# EasyEDA schematic PSU.json
TITLE: Sheet_1; REV: 1.0; Date: 2023-02-11; Sheet: 1/1; Company: Your Company
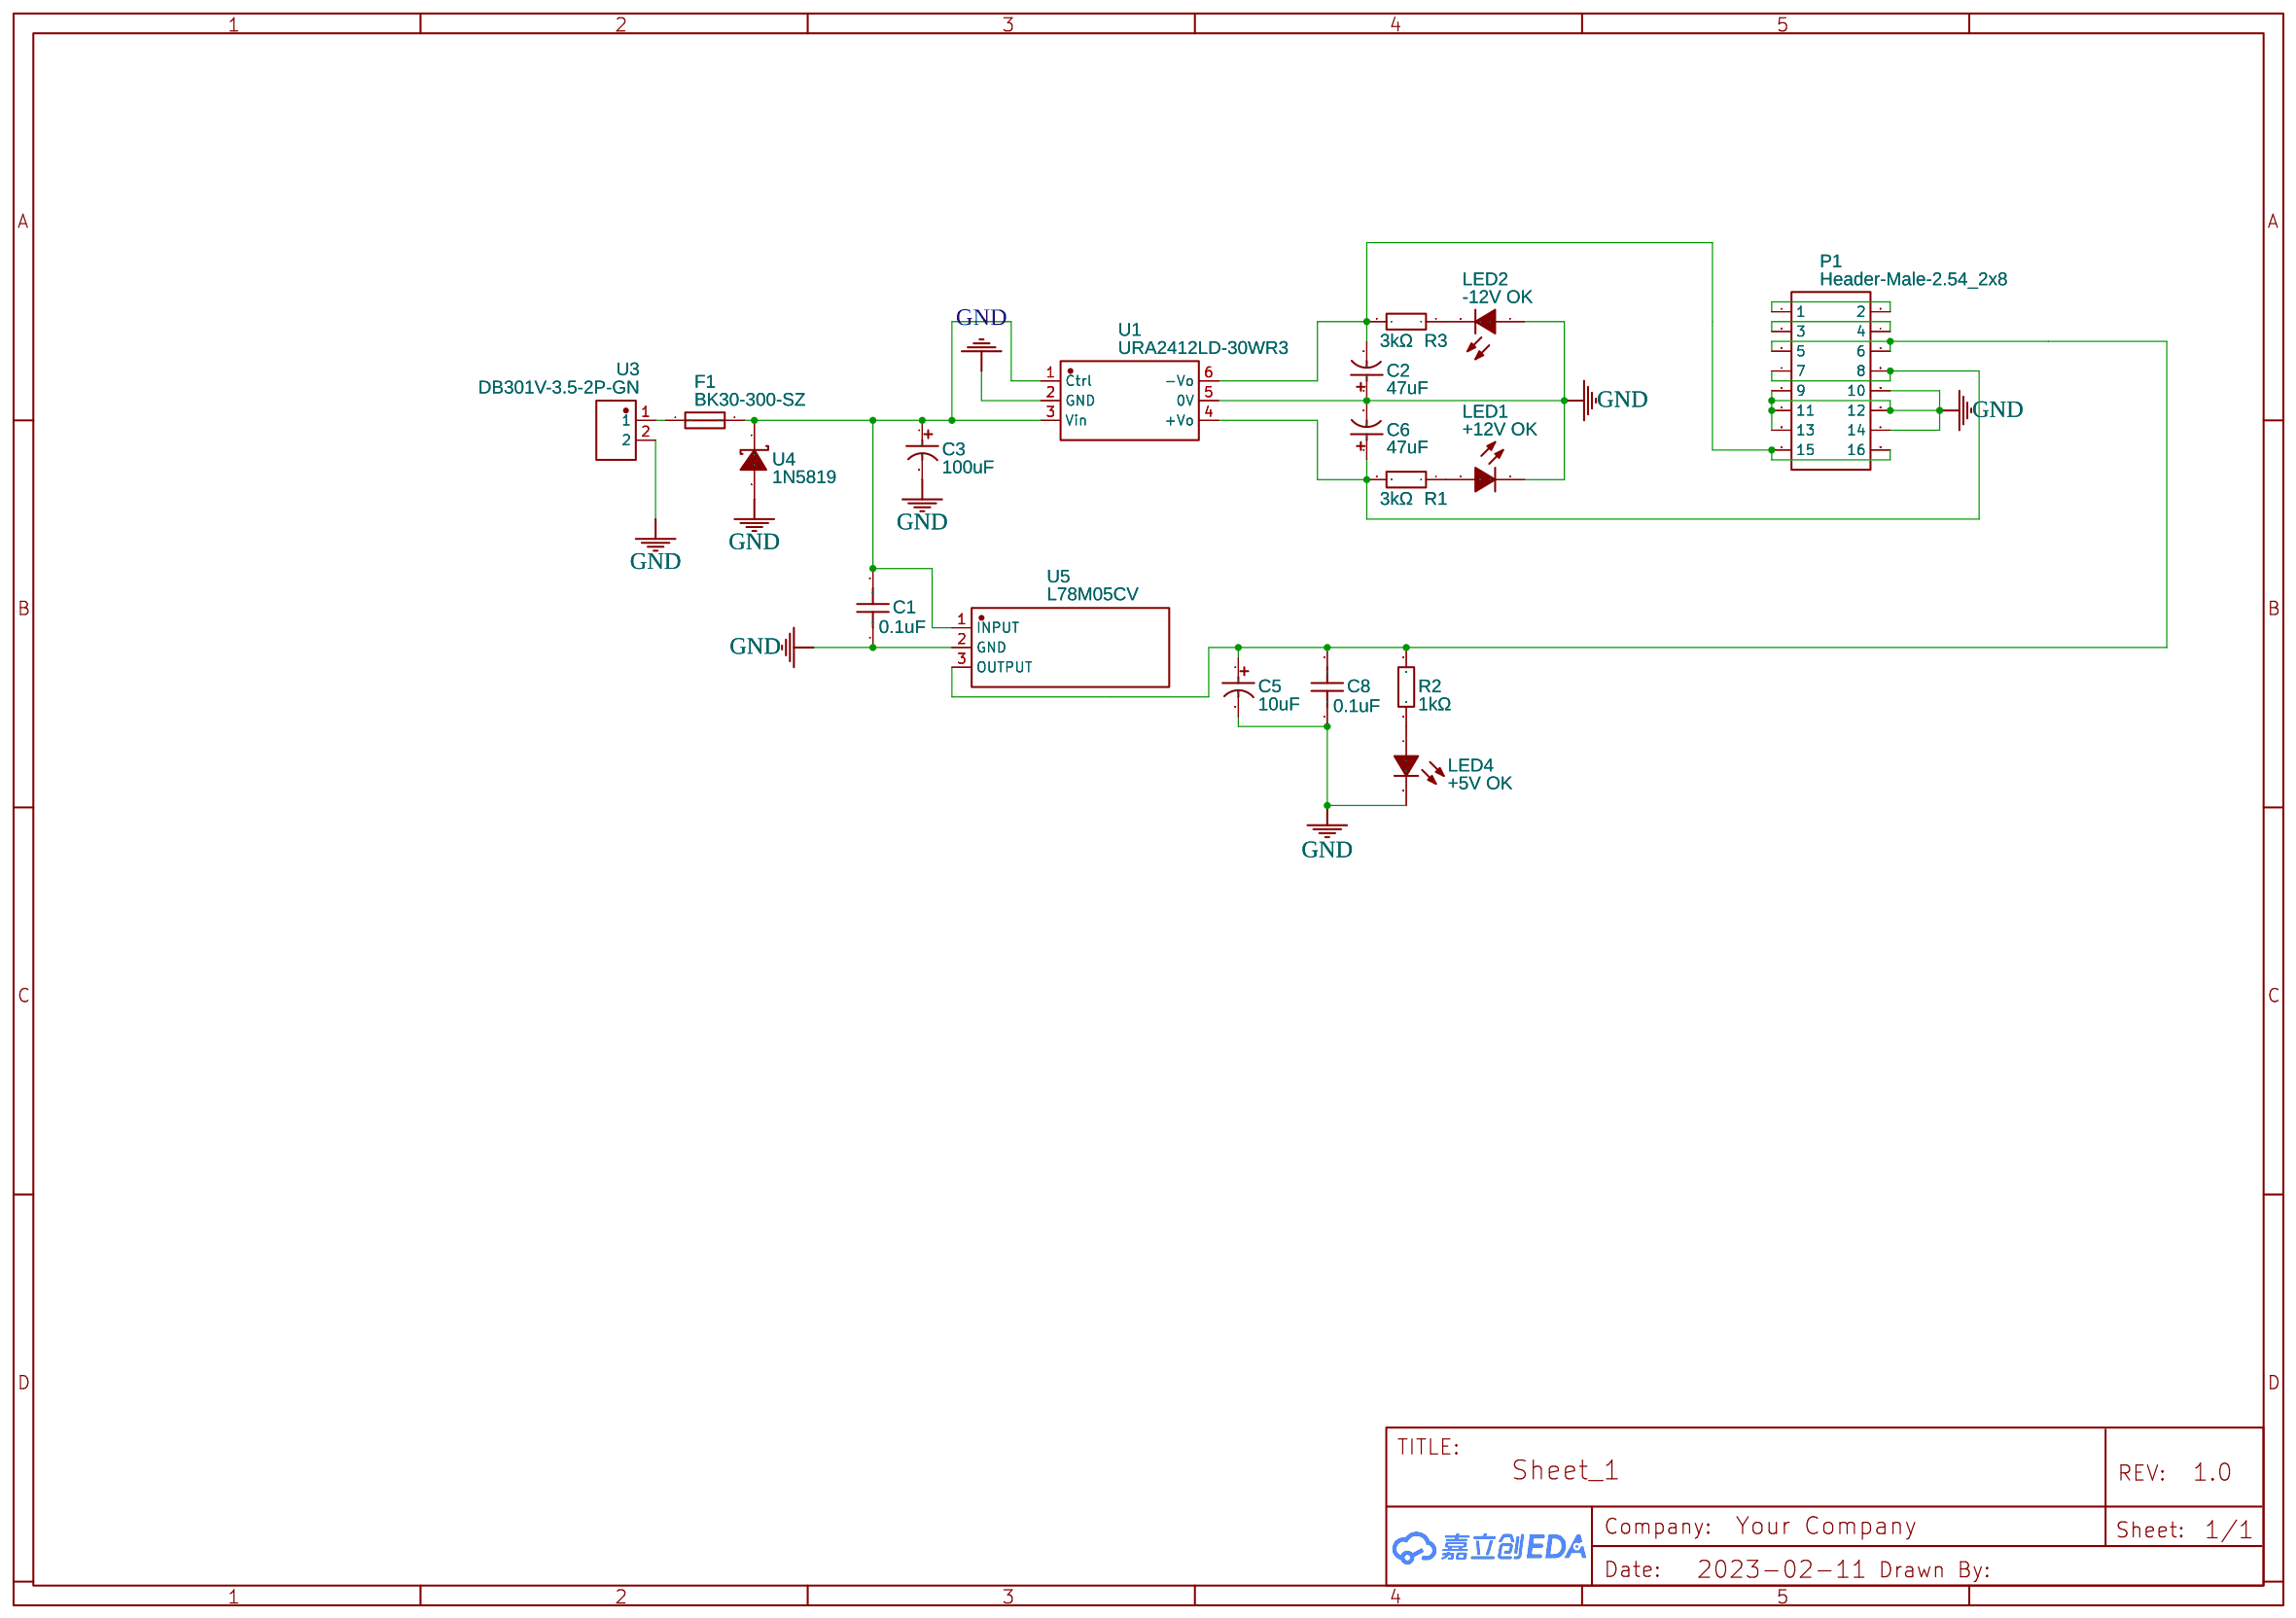
[diagram p0: schematic sheet]

## Parts
C1  0.1uF  [CAP-TH_L6.5-W3.5-P5.00-D0.5-1]
C2  47uF  [CAP-TH_BD5.0-P2.00-D0.8-FD]
C3  100uF  [CAP-TH_BD8.0-P3.50-D0.6-FD]
C5  10uF  [CAP-TH_BD4.0-P1.50-D0.8-FD]
C6  47uF  [CAP-TH_BD5.0-P2.00-D0.8-FD]
C8  0.1uF  [CAP-TH_L6.5-W3.5-P5.00-D0.5-1]
F1  BK30-300-SZ  [FUSE-TH_L13.5-W3.0-P5.08-D1.0-S1.2]
LED1  +12V OK  [LED-TH_BD3.0-P2.54-FD]
LED2  -12V OK  [LED-TH_BD3.0-P2.54-FD]
LED4  +5V OK  [LED-TH_BD3.0-P2.54-FD]
P1  Header-Male-2.54_2x8  [HDR-TH_16P-P2.54-V-M-R2-C8-S2.54]
R1  3kΩ  [RES-TH_BD1.9-L3.3-P7.30-D0.5]
R2  1kΩ  [RES-TH_BD1.9-L3.3-P7.30-D0.5]
R3  3kΩ  [RES-TH_BD1.9-L3.3-P7.30-D0.5]
U1  URA2412LD-30WR3  [PWRM-TH_URAXXXXLD-30WR3]
U3  DB301V-3.5-2P-GN  [CONN-TH_DB301V-3.5-2P-GN]
U4  1N5819  [DO-41_BD2.8-L5.2-P9.20-D0.8-RD]
U5  L78M05CV  [TO-220-3_L10.0-W4.5-P2.54-L]

## Library data of the parts
C1 C8 = MPE103J100V82CL0048: Supplier: LCSC; Supplier Part: C2803188; Manufacturer: KNSCHA(科尼盛); JLCPCB Part Class: Extended Part; Contributor: lcsc
C2 C6 = 25YXF47MEFC5X11: Supplier: LCSC; Manufacturer: rubycon(红宝石); Supplier Part: C88724; JLCPCB Part Class: Extended Part
C3 = 50YXJ100M8X11.5: Supplier: LCSC; Manufacturer: rubycon(红宝石); Supplier Part: C88859; JLCPCB Part Class: Extended Part
C5 = 25MS710MEFC4X7: Supplier: LCSC; Manufacturer: rubycon(红宝石); Supplier Part: C88739; JLCPCB Part Class: Extended Part
F1 = BK30-300-SZ: Supplier: LCSC; Supplier Part: C194051; Manufacturer: Brightking(君耀电子); Contributor: LCSC; JLCPCB Part Class: Extended Part
LED1 LED2 LED4 = 204-10SURD/S530-A3-L: Supplier: LCSC; Manufacturer: EVERLIGHT(亿光); Supplier Part: C99771; JLCPCB Part Class: Extended Part
P1 = Header-Male-2.54_2x8: Supplier: LCSC; Manufacturer: BOOMELE(博穆精密); Manufacturer Part: 2.54-2*8P针; Supplier Part: C68234; JLCPCB Part Class: Extended Part
R1-R3 = MFR0W8F1001A50: Supplier: LCSC; Manufacturer: UNI-ROYAL(厚声); Supplier Part: C58674; Resistance (Ohms): 1K; JLCPCB Part Class: Extended Part
U1 = URA2412LD-30WR3: Supplier: LCSC; Supplier Part: C2757488; Manufacturer: MORNSUN(金升阳); Contributor: LCSC; JLCPCB Part Class: Extended Part
U3 = DB301V-3.5-2P-GN: Supplier: LCSC; Supplier Part: C695629; Manufacturer: DIBO; Contributor: LCSC; JLCPCB Part Class: Extended Part
U4 = 1N5819_C3039965: Supplier: LCSC; Supplier Part: C3039965; Manufacturer: YFW(佑风微); link: https://atta.szlcsc.comnull; Contributor: lcsc
U5 = L78M05CV: Supplier: LCSC; Supplier Part: C283462; Manufacturer: ST(意法半导体); Contributor: LCSC; JLCPCB Part Class: Extended Part

## Nets
GND: C1.1 C2.1 C3.2 C5.2 C6.2 C8.1 LED1.2(K) LED2.1(A) LED4.2(K) P1.9 P1.10 P1.11 P1.12 P1.13 P1.14 U1.2(GND) U1.5(0V) U3.2 U4.2(A) U5.2(GND)
Net-(C1-2): C1.2 C3.1 F1.2 U1.1(Ctrl) U1.3(Vin) U4.1(K) U5.1(INPUT)
Net-(C2-2): C2.2 P1.15 P1.16 R3.2 U1.6(-Vo)
Net-(C5-1): C5.1 C8.2 P1.5 P1.6 R2.2 U5.3(OUTPUT)
Net-(C6-1): C6.1 P1.7 P1.8 R1.2 U1.4(+Vo)
Net-(F1-1): F1.1 U3.1
Net-(LED1-1): LED1.1(A) R1.1
Net-(LED2-2): LED2.2(K) R3.1
Net-(LED4-1): LED4.1(A) R2.1
Net-(P1-1): P1.1 P1.2
Net-(P1-3): P1.3 P1.4
